# Altium schematic sheet STM32F030C8T6.SchDoc
size A4; SheetNumber: 3; SheetTotal: 4
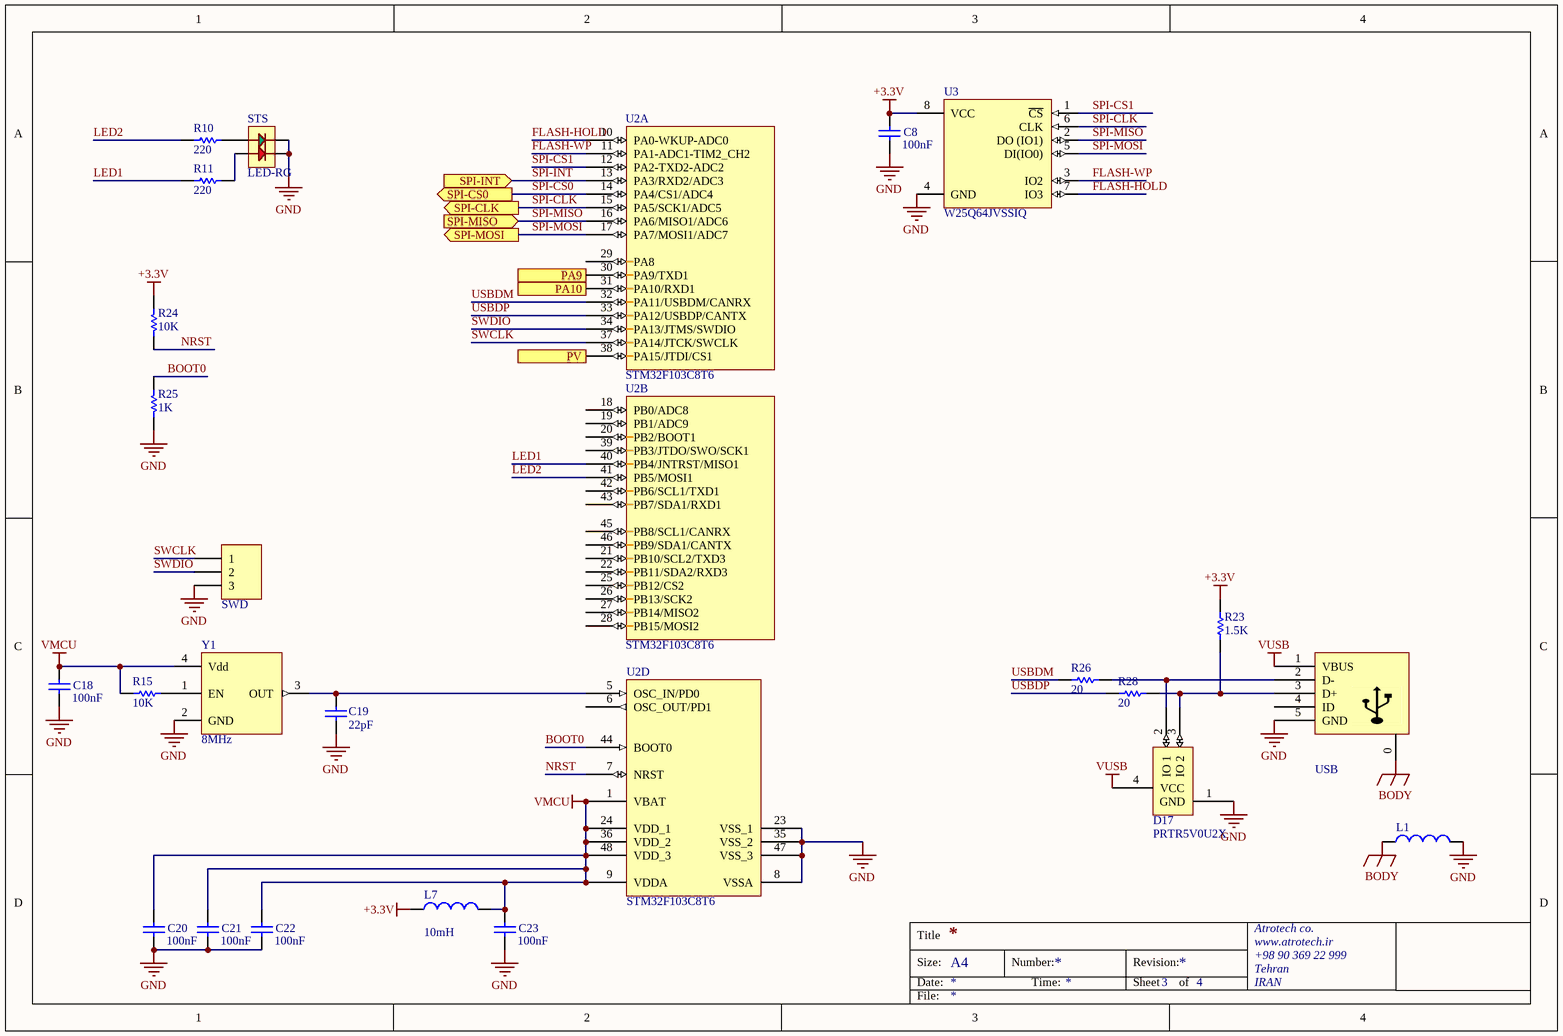
[diagram p0: STM32F030C8T6.SchDoc]

## Parts
C8  100nF  [C603]
C18  100nF  [C603]
C19  22pF  [C603]
C20  100nF  [C603]
C21  100nF  [C603]
C22  100nF  [C603]
C23  100nF  [C603]
D17  PRTR5V0U2X  [SOT-143B]
L1  Inductor  [R805]  (value not drawn)
L7  value 10mH  [R805]  (hidden comment: Inductor)
R10  220  [R0603]
R11  220  [R0603]
R15  10K  [R0603]
R23  1.5K  [R0603]
R24  10K  [R0603]
R25  1K  [R0603]
R26  20  [R0603]
R28  20  [R0603]
STS  LED-RG  [LED-1210]
SWD  CONN-3  [PHDR3]  (value not drawn)
U2  STM32F103C8T6  [LQFP-48]  (parts A,B,D of 4)
U3  W25Q64JVSSIQ  [SOIC-8W]
USB  USB MINI  [USB-MINI-SMD]  (value not drawn)
Y1  8MHz  [ASV]

## Ports
PA9 (out), PA10 (out), PV (out), SPI-CLK (out), SPI-CS0 (out), SPI-INT (in), SPI-MISO (in), SPI-MOSI (out)

## Nets
+3.3V: C8.2 L7.1 R23.1 R24.2 U3.8(VCC)
BODY: L1.1 USB.0(BODY)
GND: C8.1 C18.1 C19.2 C20.1 C21.1 C22.1 C23.1 D17.1(GND) L1.2 R25.1 STS.3(RED-C) STS.4(GRN-C) SWD.3 U2.8(VSSA) U2.23(VSS_1) U2.35(VSS_2) U2.47(VSS_3) U3.4(GND) USB.5(GND) Y1.2(GND)
VMCU: C18.2 C20.2 C21.2 C22.2 C23.2 L7.2 R15.2 U2.1(VBAT) U2.9(VDDA) U2.24(VDD_1) U2.36(VDD_2) U2.48(VDD_3) Y1.4(Vdd)
VUSB: D17.4(VCC) USB.1(VBUS)
BOOT0: R25.2 U2.44(BOOT0)
FLASH-HOLD: U2.10(PA0-WKUP-ADC0) U3.7(IO3)
FLASH-WP: U2.11(PA1-ADC1-TIM2_CH2) U3.3(IO2)
LED1: R11.2 U2.40(PB4/JNTRST/MISO1)
LED2: R10.2 U2.41(PB5/MOSI1)
NRST: R24.1 U2.7(NRST)
PA9: U2.30(PA9/TXD1) ; port PA9
PA10: U2.31(PA10/RXD1) ; port PA10
PV: U2.38(PA15/JTDI/CS1) ; port PV
SPI-CLK: U2.15(PA5/SCK1/ADC5) U3.6(CLK) ; port SPI-CLK
SPI-CS0: U2.14(PA4/CS1/ADC4) ; port SPI-CS0
SPI-CS1: U2.12(PA2-TXD2-ADC2) U3.1(~{CS})
SPI-INT: U2.13(PA3/RXD2/ADC3) ; port SPI-INT
SPI-MISO: U2.16(PA6/MISO1/ADC6) U3.2(DO_(IO1)) ; port SPI-MISO
SPI-MOSI: U2.17(PA7/MOSI1/ADC7) U3.5(DI(IO0)) ; port SPI-MOSI
SWCLK: SWD.1 U2.37(PA14/JTCK/SWCLK)
SWDIO: SWD.2 U2.34(PA13/JTMS/SWDIO)
USBDM: R26.2 U2.32(PA11/USBDM/CANRX)
USBDP: R28.2 U2.33(PA12/USBDP/CANTX)
NetC19_1: C19.1 U2.5(OSC_IN/PD0) Y1.3(OUT)
NetD17_2: D17.2(IO_1) R26.1 USB.2(D-)
NetD17_3: D17.3(IO_2) R23.2 R28.1 USB.3(D+)
NetR10_1: R10.1 STS.1(GRN-A)
NetR11_1: R11.1 STS.2(RED-A)
NetR15_1: R15.1 Y1.1(EN)

Not connected (* = marked no-connect by the designer): U2 6(OSC_OUT/PD1) 18(PB0/ADC8) 19(PB1/ADC9) 20(PB2/BOOT1) 21(PB10/SCL2/TXD3) 22(PB11/SDA2/RXD3) 25(PB12/CS2) 26(PB13/SCK2) 27(PB14/MISO2) 28(PB15/MOSI2) 29(PA8) 39(PB3/JTDO/SWO/SCK1) 42(PB6/SCL1/TXD1) 43(PB7/SDA1/RXD1) 45(PB8/SCL1/CANRX) 46(PB9/SDA1/CANTX); USB 4(ID)

## Notes on the sheet
- Title
- Size:
- Date:
- A4
- Number:
- Time:
- Revision:
- Sheet
- of
- Atrotech co.
- www.atrotech.ir
- +98 90 369 22 999
- Tehran
- IRAN
- File:

## Library data of the parts
C8 C18-C23 = Cap: Capacitor; Designer: Parsa Malekpour
  C8 C18 C20-C23: Value: 100nF
  C19: Value: 22pF
D17 = PRTR5V0U2X: Ultra low capacitance double rail-to-rail ESD protection diode; reverse standoff voltage: 5.5V
L1 = Inductor: Code_IEC: 1005; Value: 10mH; Published: 8-Jun-2000; LatestRevisionDate: 29-May-2009; LatestRevisionNote: IPC-7351 Footprint Added.; PackageReference: 0402-A; Publisher: Altium Limited; PackageDescription: Chip Inductor; Code_JEITA: 0402
L7 = Inductor: Code_IEC: 1005; Published: 8-Jun-2000; LatestRevisionDate: 29-May-2009; LatestRevisionNote: IPC-7351 Footprint Added.; PackageReference: 0402-A; Publisher: Altium Limited; PackageDescription: Chip Inductor; Code_JEITA: 0402
R10 R11 R15 R23-R26 R28 = Resistor: Designer: Parsa Malekpour
  R10 R11: Value: 220
  R15 R24: Value: 10K
  R23: Value: 1.5K
  R25: Value: 1K
  R26 R28: Value: 20
STS = LED-RG-4
SWD = CONN-3: Header, 3-Pin
U2 = STM32F103C8T6: STM32 ARM-based 32-bit MCU with 64 Kbytes Flash, 48-pin LQFP, Industrial Temperature; Published: 30-May-2008; DatasheetVersion: rev6, Mar-2008; PackageVersion: Mar-2008; PackageReference: LQFP48; Publisher: Altium Limited; PackageDescription: 48-Pin Low-Profile Quad Flat Pack, 7 x 7 mm Body, 0.5 mm Pitch (LQFP48); ComponentLink1Description: Manufacturer Link; ComponentLink1URL: www.st.com/stm32; ComponentLink2Description: Datasheet; ComponentLink2URL: http://www.st.com/stonline/products/literature/ds/13587.pdf
Y1 = OSCILLATOR: Frequency: 8MHz